# Altium schematic sheet Cover.SchDoc
size Legal; CompanyName: SINEBOTICS; DrawnBy: Tharnath Bagirathan; SheetNumber: 1; SheetTotal: 3
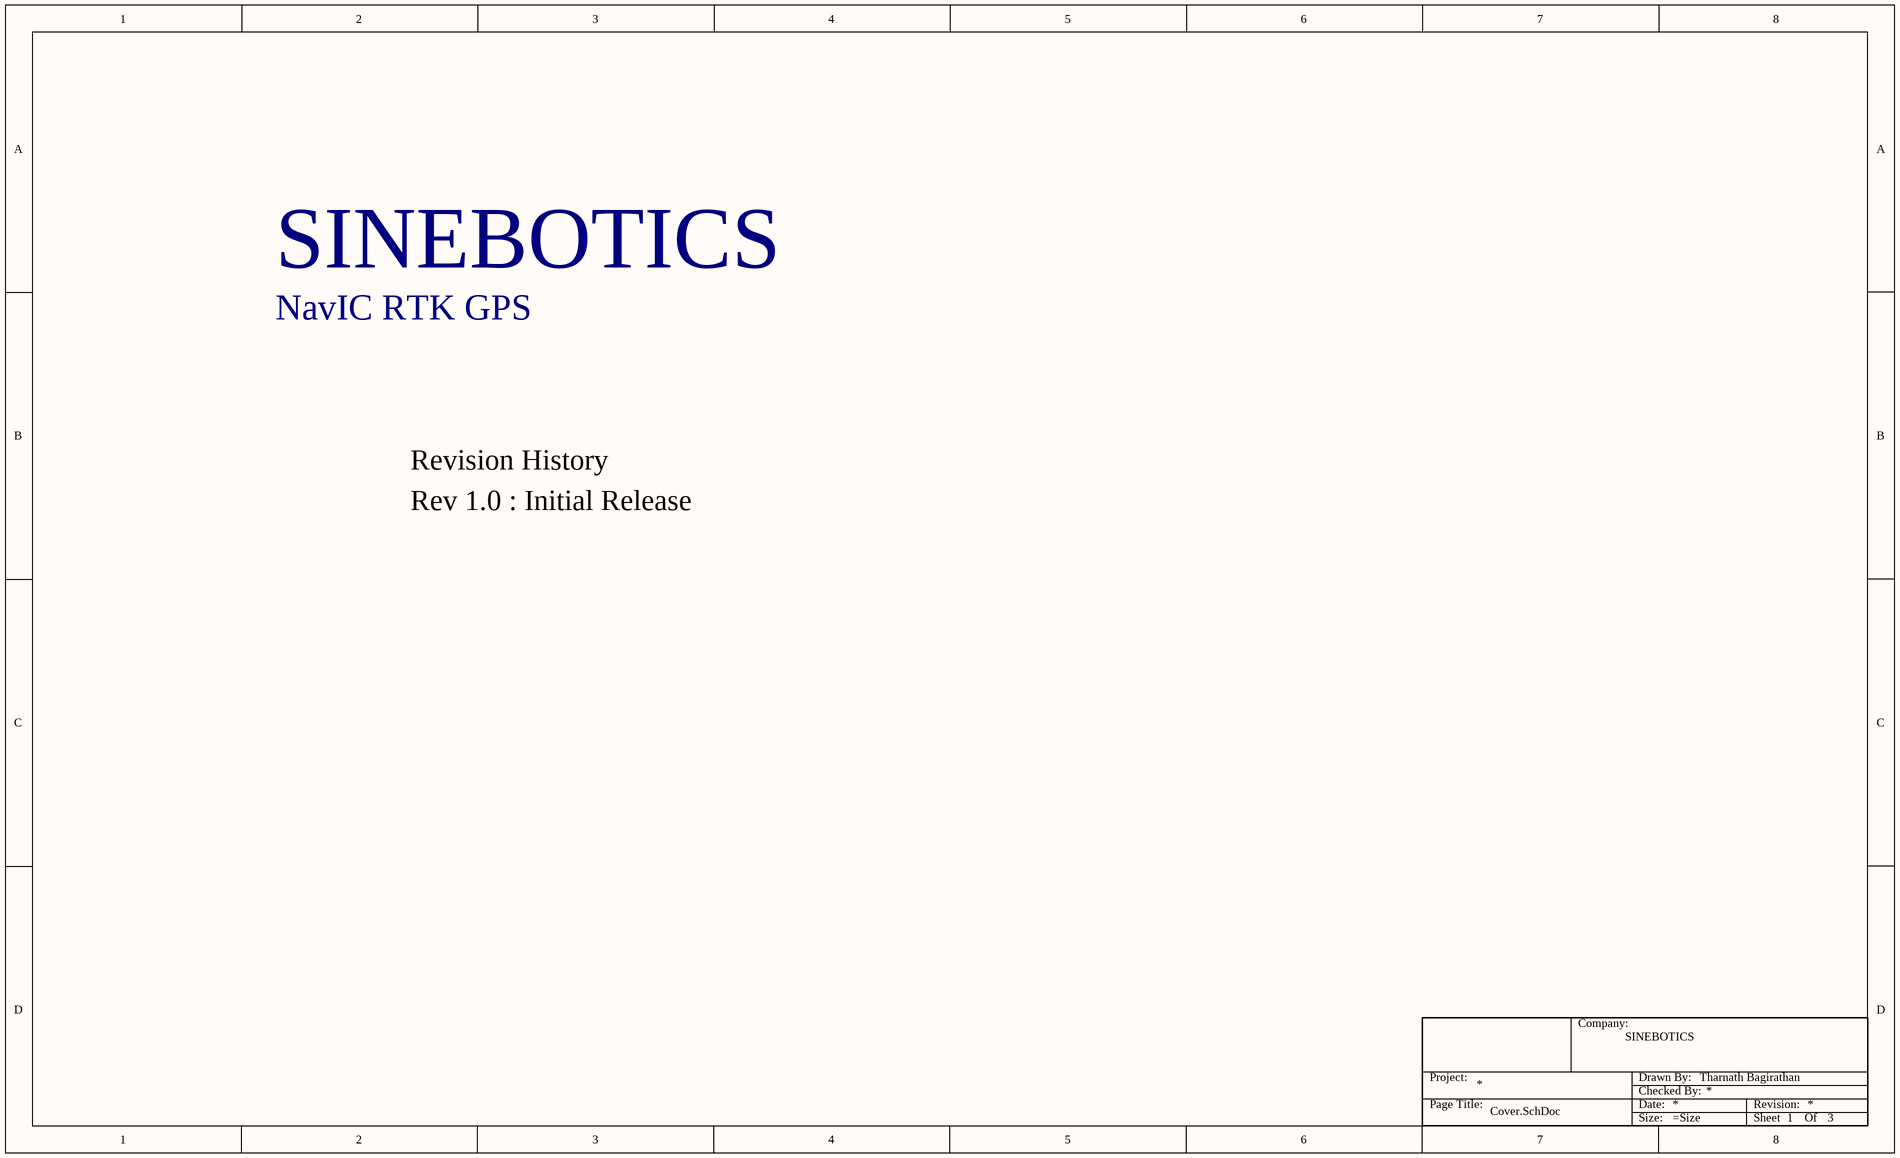
[diagram p0: Cover.SchDoc]

## Parts
TitleBlock  TitleBlock  (value not drawn)  (graphical)

## Notes on the sheet
- SINEBOTICS
- NavIC RTK GPS
- Revision History
- Rev 1.0 : Initial Release
- (in symbol TitleBlock) Company:; Project:; Drawn By:; Checked By:; Page Title:; Date:; Revision:; Size:; Sheet        Of

## Library data of the parts
TitleBlock = TitleBlock: TitleBlock For Schematics